# Altium project STM32F103C8T6_Mini_System.PrjPcb
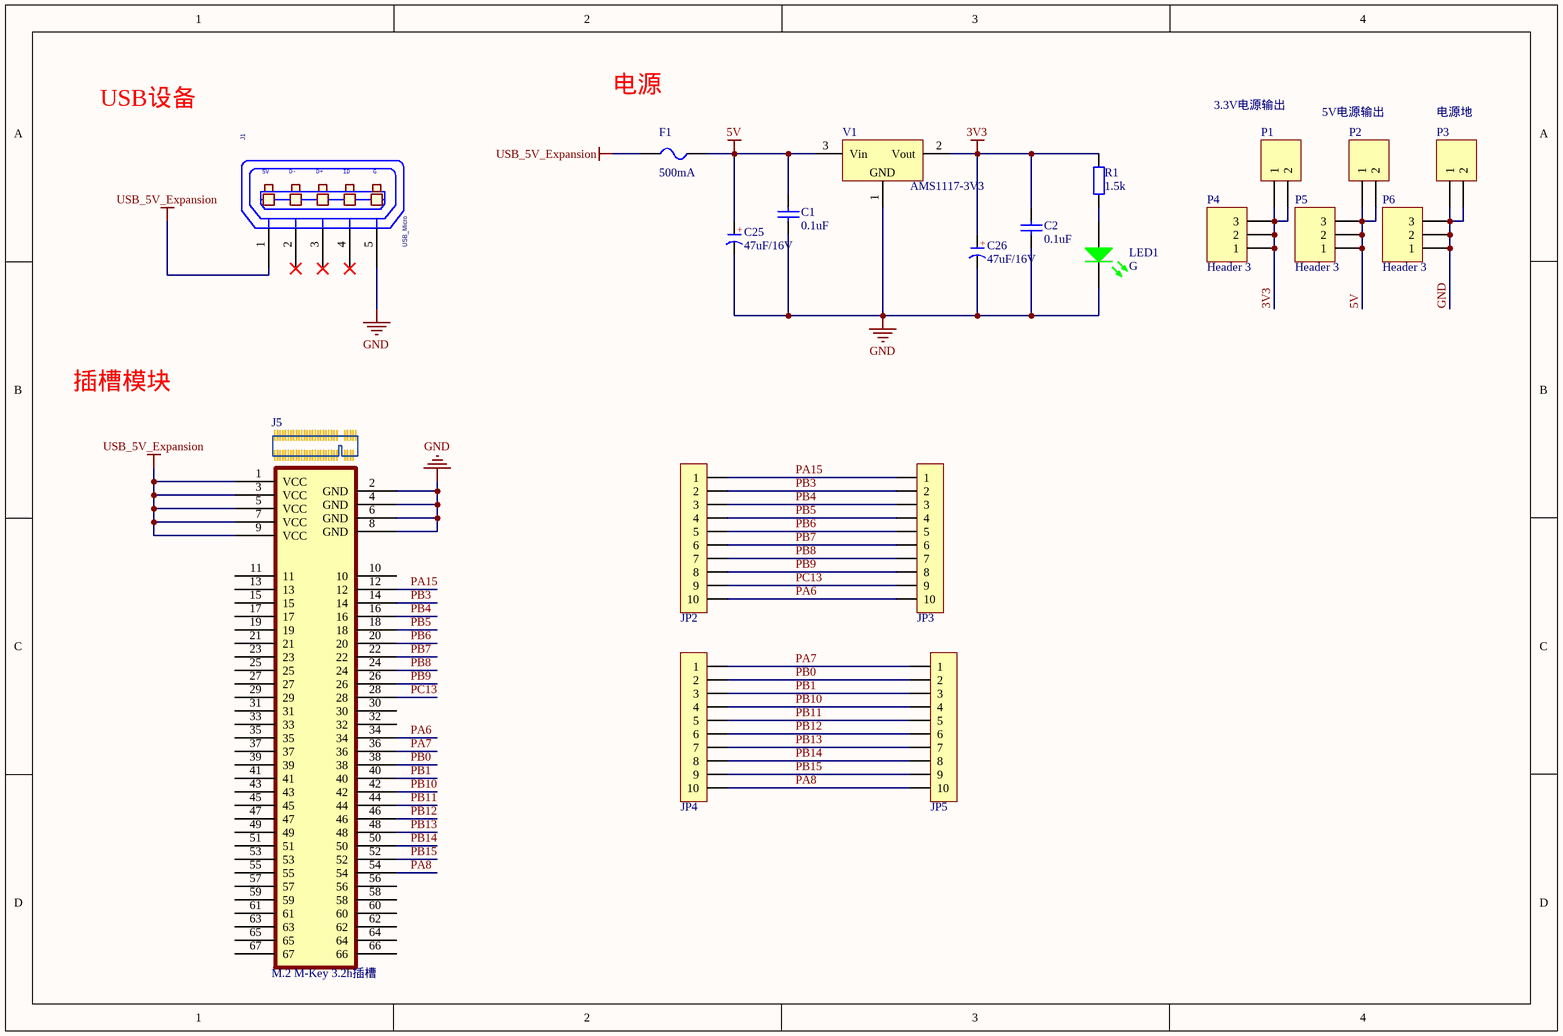
[diagram p0: Expansion_Board.SchDoc]
2 sheets, 85 parts. Net scope: global (net labels, ports and power ports of the same name join across sheets).
Board files: Expansion_Board.PcbDoc, Core_Board.PcbDoc
Sheets:
  Expansion_Board.SchDoc
  Core_Board.SchDoc

## Sheet Expansion_Board.SchDoc
size A4; SheetNumber: 1; SheetTotal: 2

### Parts
C1  0.1uF  [0805_C]
C2  0.1uF  [0805_C]
C25  47uF/16V  [CM C(5*5.4)]
C26  47uF/16V  [CM C(5*5.4)]
F1  500mA  [FU 1210]
J1  USB_Micro  [USB-MICRO]
J5  M.2 M-Key 3.2h插槽  [M-Key Socket]
JP2  HDR-1X10  [HDR2.54-LI-10P]  (value not drawn)
JP3  HDR-1X10  [HDR2.54-M-LI-10P]  (value not drawn)
JP4  HDR-1X10  [HDR2.54-LI-10P]  (value not drawn)
JP5  HDR-1X10  [HDR2.54-M-LI-10P]  (value not drawn)
LED1  G  [LED 0805G]
P1  3.3V电源输出  [KF128-5.08-2P]
P2  5V电源输出  [KF128-5.08-2P]
P3  电源地  [KF128-5.08-2P]
P4  Header 3  [HDR-1X3_M]
P5  Header 3  [HDR-1X3_M]
P6  Header 3  [HDR-1X3_M]
R1  1.5k  [0805_R]
V1  AMS1117-3V3  [SOT223]

### Nets
3V3: C2.2 C26.1(A) P1.1 P1.2 P4.1 P4.2 P4.3 R1.2 V1.2(Vout)
5V: C1.2 C25.1(A) F1.2 P2.1 P2.2 P5.1 P5.2 P5.3 V1.3(Vin)
GND: C1.1 C2.1 C25.2(K) C26.2(K) J1.5(P5) J5.2(GND) J5.4(GND) J5.6(GND) J5.8(GND) LED1.2(K) P3.1 P3.2 P6.1 P6.2 P6.3 V1.1(GND)
USB_5V_Expansion: F1.1 J1.1(P1) J5.1(VCC) J5.3(VCC) J5.5(VCC) J5.7(VCC) J5.9(VCC)
PA6: J5.34 JP2.10 JP3.10
PA7: J5.36 JP4.1 JP5.1
PA8: J5.54 JP4.10 JP5.10
PA15: J5.12 JP2.1 JP3.1
PB0: J5.38 JP4.2 JP5.2
PB1: J5.40 JP4.3 JP5.3
PB3: J5.14 JP2.2 JP3.2
PB4: J5.16 JP2.3 JP3.3
PB5: J5.18 JP2.4 JP3.4
PB6: J5.20 JP2.5 JP3.5
PB7: J5.22 JP2.6 JP3.6
PB8: J5.24 JP2.7 JP3.7
PB9: J5.26 JP2.8 JP3.8
PB10: J5.42 JP4.4 JP5.4
PB11: J5.44 JP4.5 JP5.5
PB12: J5.46 JP4.6 JP5.6
PB13: J5.48 JP4.7 JP5.7
PB14: J5.50 JP4.8 JP5.8
PB15: J5.52 JP4.9 JP5.9
PC13: J5.28 JP2.9 JP3.9
NetLED1_1: LED1.1(A) R1.1

Not connected (* = marked no-connect by the designer): J1 2(P2)* 3(P3)* 4(P4)*; J5 10 11 13 15 17 19 21 23 25 27 29 30 31 32 33 35 37 39 41 43 45 47 49 51 53 55 56 57 58 59 60 61 62 63 64 65 66 67

### Notes on the sheet
- USB设备
- 电源
- 插槽模块
- 工程名：
- 设计者：江瀚林&Jarvis
- 日期：
- 班级：
- 文档路径：
- (in symbol Cap_ELE) +
- (in symbol USB_Micro) 5V; D-; D+; ID; G

### Library data of the parts
C1 C2 = Cap_SMD: 0805贴片电容; Value: 100nF; Voltage: 63V; Published: 8-Jun-2000; Revision: July-2002: Re-released for DXP Platform.; Publisher: Altium Limited; 实物样品照片: https://item.taobao.com/item.htm?spm=a230r.1.14.32.21fd24b7VWml4d&id=37914290992&ns=1&abbucket=13#detail
C25 C26 = Cap_ELE: 电解电容
F1 = FU: 贴片保险丝; 版权归属: 源创客; BOM名称: 贴片保险丝; 学习资源: www.ooocke.com
J1 = USB_Micro: CLASS: IO; AGILE_PN: 211-80104; MFG_NAME01: ANYTRONIC CORPORATION LIMITED; MFG_PN01: 23970101#LCP-58LF; Temp_Range: -55&#8451; to 105&#8451;; CAD_APPROVED: Yes; ROHS: Yes; HEIGHT: 2.8MM
J5 = M-Key Socket
JP2-JP5 = Header 10: 10P接插件; 版权归属: 源创客; BOM名称: 10P接插件; 学习资源: www.ooocke.com
LED1 = LED_G: 绿色LED; Published: 8-Jun-2000; Revision: July-2002: Re-released for DXP Platform.; Publisher: Altium Limited
P1-P3 = Header 2: 2P接插件; LatestRevisionDate: 17-Jul-2002; LatestRevisionNote: Re-released for DXP Platform.; Publisher: Altium Limited
P4-P6 = Header 3: 3P接插件; LatestRevisionDate: 17-Jul-2002; LatestRevisionNote: Re-released for DXP Platform.; Publisher: Altium Limited
R1 = Res_SMD: 0805贴片电阻; Value: 1K; Published: 8-Jun-2000; LatestRevisionDate: 17-Jul-2002; LatestRevisionNote: Re-released for DXP Platform.; PackageReference: AXIAL-0.4; Publisher: Altium Limited; PackageDescription: Axial Device, Thru-Hole; 2 Leads; 0.4 in Pin Spacing
V1 = AMS1117: 三端稳压芯片; BOM名称: 稳压芯片; 版权归属: 源创客; 学习资源: www.ooocke.com

## Sheet Core_Board.SchDoc
size A2; SheetNumber: 2; SheetTotal: 2
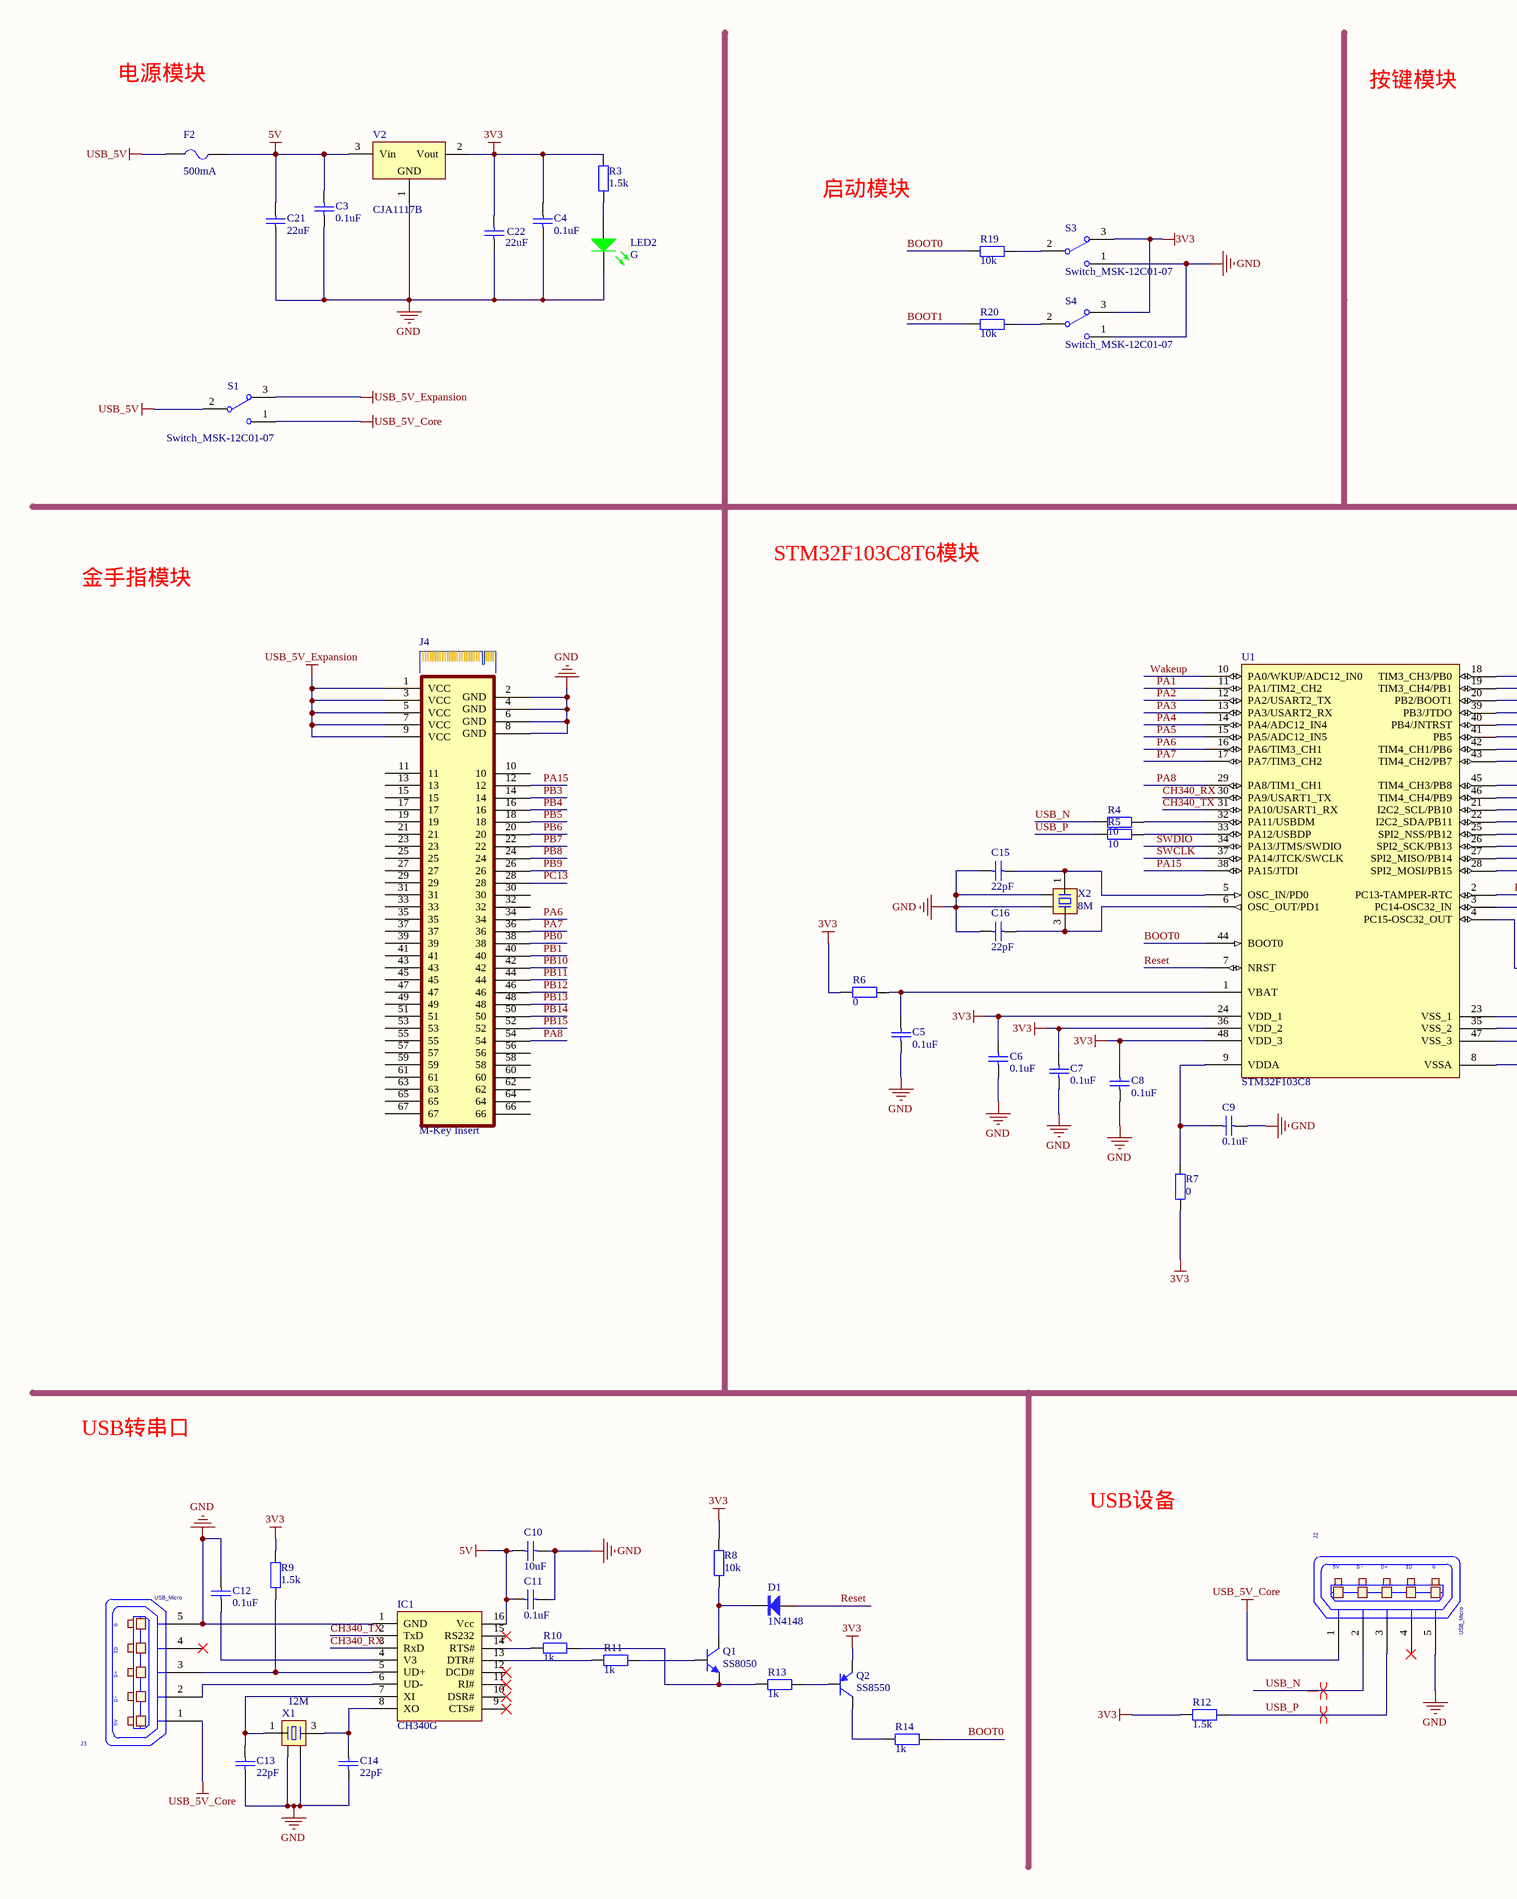
[diagram p1: Core_Board.SchDoc, left]
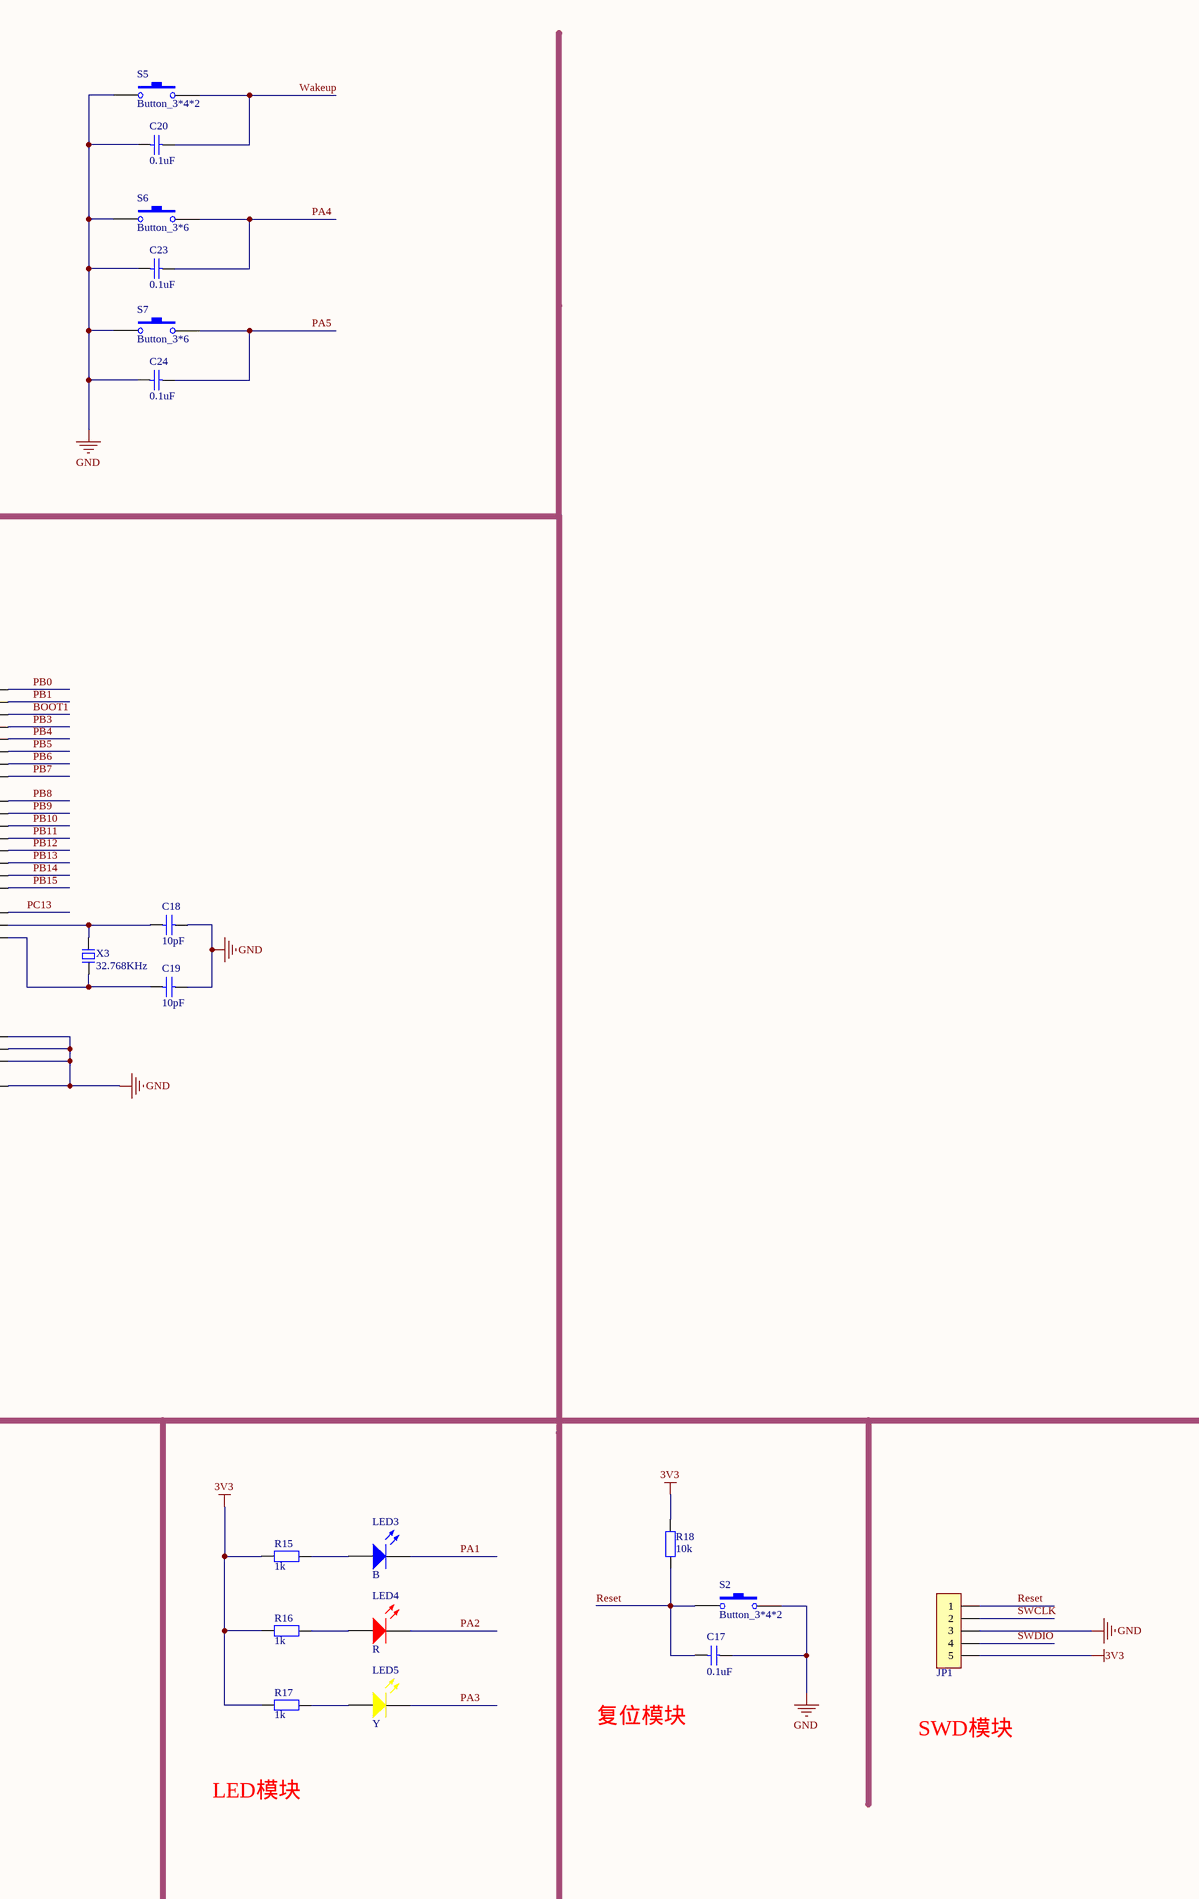
[diagram p2: Core_Board.SchDoc, right]

### Parts
C3  0.1uF  [0805_C]
C4  0.1uF  [0805_C]
C5  0.1uF  [0805_C]
C6  0.1uF  [0805_C]
C7  0.1uF  [0805_C]
C8  0.1uF  [0805_C]
C9  0.1uF  [0805_C]
C10  10uF  [0805_C]
C11  0.1uF  [0805_C]
C12  0.1uF  [0805_C]
C13  22pF  [0805_C]
C14  22pF  [0805_C]
C15  22pF  [0805_C]
C16  22pF  [0805_C]
C17  0.1uF  [0805_C]
C18  10pF  [0805_C]
C19  10pF  [0805_C]
C20  0.1uF  [0805_C]
C21  22uF  [0805_C]
C22  22uF  [0805_C]
C23  0.1uF  [0805_C]
C24  0.1uF  [0805_C]
D1  1N4148  [MINI_MELF (LL34)]
F2  500mA  [FU 1210]
IC1  CH340G  [SOP16_N]
J2  USB_Micro  [USB-MICRO]
J3  USB_Micro  [USB-MICRO]
J4  M-Key Insert  [M-Key Insert]
JP1  HDR-1X5  [XH2.54-WI-5P]  (value not drawn)
LED2  G  [LED 0805G]
LED3  B  [LED 0805B]
LED4  R  [LED 0805R]
LED5  Y  [LED 0805Y]
Q1  SS8050  [SOT23-3N]
Q2  SS8550  [SOT23-3N]
R3  1.5k  [0805_R]
R4  10  [0805_R]
R5  10  [0805_R]
R6  0  [0805_R]
R7  0  [0805_R]
R8  10k  [0805_R]
R9  1.5k  [0805_R]
R10  1k  [0805_R]
R11  1k  [0805_R]
R12  1.5k  [0805_R]
R13  1k  [0805_R]
R14  1k  [0805_R]
R15  1k  [0805_R]
R16  1k  [0805_R]
R17  1k  [0805_R]
R18  10k  [0805_R]
R19  10k  [0805_R]
R20  10k  [0805_R]
S1  Switch_MSK-12C01-07  [MSK-12C01-07]
S2  Button_3*4*2  [TSW SMD-3*4*2]
S3  Switch_MSK-12C01-07  [MSK-12C01-07]
S4  Switch_MSK-12C01-07  [MSK-12C01-07]
S5  Button_3*4*2  [TSW SMD-3*4*2]
S6  Button_3*6  [TSW SMD-3*6*4.3_V]
S7  Button_3*6  [TSW SMD-3*6*4.3_V]
U1  STM32F103C8  [LQFP48 7X7_N]
V2  CJA1117B  [SOT89_N]
X1  12M  [OSC 3225-4P]
X2  8M  [OSC 3225-4P]
X3  32.768KHz  [OSC 3215-2P]

### Nets
3V3: C4.2 C6.2 C7.2 C8.2 C22.2 JP1.5 Q2.2(E) R3.2 R6.1 R7.1 R8.2 R9.1 R12.1 R15.1 R16.1 R17.1 R18.1 S3.3 S4.3 U1.24(VDD_1) U1.36(VDD_2) U1.48(VDD_3) V2.2(Vout)
5V: C3.2 C10.2 C11.2 C21.2 F2.2 IC1.16(Vcc) V2.3(Vin)
GND: C3.1 C4.1 C5.1 C6.1 C7.1 C8.1 C9.1 C10.1 C11.1 C12.2 C13.1 C14.1 C15.2 C16.2 C17.1 C18.2 C19.2 C20.1 C21.1 C22.1 C23.1 C24.1 IC1.1(GND) J2.5(P5) J3.5(P5) J4.2(GND) J4.4(GND) J4.6(GND) J4.8(GND) JP1.3 LED2.2(K) S2.2 S3.1 S4.1 S5.1 S6.1 S7.1 U1.8(VSSA) U1.23(VSS_1) U1.35(VSS_2) U1.47(VSS_3) V2.1(GND) X1.2 X1.4 X2.2 X2.4
USB_5V: F2.1 S1.2
USB_5V_Core: J2.1(P1) J3.1(P1) S1.1
USB_5V_Expansion: J4.1(VCC) J4.3(VCC) J4.5(VCC) J4.7(VCC) J4.9(VCC) S1.3
BOOT0: R14.1 R19.1 U1.44(BOOT0)
BOOT1: R20.1 U1.20(PB2/BOOT1)
CH340_RX: IC1.3(RxD) U1.30(PA9/USART1_TX)
CH340_TX: IC1.2(TxD) U1.31(PA10/USART1_RX)
PA1: LED3.2(K) U1.11(PA1/TIM2_CH2)
PA2: LED4.2(K) U1.12(PA2/USART2_TX)
PA3: LED5.2(K) U1.13(PA3/USART2_RX)
PA4: C23.2 S6.2 U1.14(PA4/ADC12_IN4)
PA5: C24.2 S7.2 U1.15(PA5/ADC12_IN5)
PA6: J4.34 U1.16(PA6/TIM3_CH1)
PA7: J4.36 U1.17(PA7/TIM3_CH2)
PA8: J4.54 U1.29(PA8/TIM1_CH1)
PA15: J4.12 U1.38(PA15/JTDI)
PB0: J4.38 U1.18(TIM3_CH3/PB0)
PB1: J4.40 U1.19(TIM3_CH4/PB1)
PB3: J4.14 U1.39(PB3/JTDO)
PB4: J4.16 U1.40(PB4/JNTRST)
PB5: J4.18 U1.41(PB5)
PB6: J4.20 U1.42(TIM4_CH1/PB6)
PB7: J4.22 U1.43(TIM4_CH2/PB7)
PB8: J4.24 U1.45(TIM4_CH3/PB8)
PB9: J4.26 U1.46(TIM4_CH4/PB9)
PB10: J4.42 U1.21(I2C2_SCL/PB10)
PB11: J4.44 U1.22(I2C2_SDA/PB11)
PB12: J4.46 U1.25(SPI2_NSS/PB12)
PB13: J4.48 U1.26(SPI2_SCK/PB13)
PB14: J4.50 U1.27(SPI2_MISO/PB14)
PB15: J4.52 U1.28(SPI2_MOSI/PB15)
PC13: J4.28 U1.2(PC13-TAMPER-RTC)
Reset: C17.2 D1.1(A) JP1.1 R18.2 S2.1 U1.7(NRST)
SWCLK: JP1.2 U1.37(PA14/JTCK/SWCLK)
SWDIO: JP1.4 U1.34(PA13/JTMS/SWDIO)
USB_N: J2.2(P2) R4.1
USB_P: J2.3(P3) R5.1 R12.2
Wakeup: C20.2 S5.2 U1.10(PA0/WKUP/ADC12_IN0)
NetC5_2: C5.2 R6.2 U1.1(VBAT)
NetC9_2: C9.2 R7.2 U1.9(VDDA)
NetC12_1: C12.1 IC1.4(V3)
NetC13_2: C13.2 IC1.7(XI) X1.1
NetC14_2: C14.2 IC1.8(XO) X1.3
NetC15_1: C15.1 U1.5(OSC_IN/PD0) X2.1
NetC16_1: C16.1 U1.6(OSC_OUT/PD1) X2.3
NetC18_1: C18.1 U1.3(PC14-OSC32_IN) X3.2
NetC19_1: C19.1 U1.4(PC15-OSC32_OUT) X3.1
NetD1_2: D1.2(K) Q1.3(C) R8.1
NetIC1_5: IC1.5(UD+) J3.3(P3) R9.2
NetIC1_6: IC1.6(UD-) J3.2(P2)
NetIC1_13: IC1.13(DTR#) R11.1
NetIC1_14: IC1.14(RTS#) R10.1
NetLED2_1: LED2.1(A) R3.1
NetLED3_1: LED3.1(A) R15.2
NetLED4_1: LED4.1(A) R16.2
NetLED5_1: LED5.1(A) R17.2
NetQ1_1: Q1.1(B) R11.2
NetQ1_2: Q1.2(E) R10.2 R13.1
NetQ2_1: Q2.1(B) R13.2
NetQ2_3: Q2.3(C) R14.2
NetR4_2: R4.2 U1.32(PA11/USBDM)
NetR5_2: R5.2 U1.33(PA12/USBDP)
NetR19_2: R19.2 S3.2
NetR20_2: R20.2 S4.2

Not connected (* = marked no-connect by the designer): IC1 9(CTS#)* 10(DSR#)* 11(RI#)* 12(DCD#)* 15(RS232)*; J2 4(P4)*; J3 4(P4)*; J4 10 11 13 15 17 19 21 23 25 27 29 30 31 32 33 35 37 39 41 43 45 47 49 51 53 55 56 57 58 59 60 61 62 63 64 65 66 67

### Layout directives
differential pair: USB_N, USB_P

### Notes on the sheet
- 电源模块
- 按键模块
- 启动模块
- 金手指模块
- STM32F103C8T6模块
- USB转串口
- USB设备
- 复位模块
- SWD模块
- LED模块
- (in symbol USB_Micro) 5V; D-; D+; ID; G

### Library data of the parts
C3-C12 C17 C20-C24 = Cap_SMD: 0805贴片电容; Value: 100nF; Voltage: 63V; Published: 8-Jun-2000; Revision: July-2002: Re-released for DXP Platform.; Publisher: Altium Limited; 实物样品照片: https://item.taobao.com/item.htm?spm=a230r.1.14.32.21fd24b7VWml4d&id=37914290992&ns=1&abbucket=13#detail
C13-C16 C18 C19 = Cap_SMD: 贴片电容; Value: 100nF; Voltage: 63V; Published: 8-Jun-2000; Revision: July-2002: Re-released for DXP Platform.; Publisher: Altium Limited; 实物样品照片: https://item.taobao.com/item.htm?spm=a230r.1.14.32.21fd24b7VWml4d&id=37914290992&ns=1&abbucket=13#detail
D1 = 1N4148: 高速开关二极管; 版权归属: 源创客; BOM名称: 高速开关二极管; 学习资源: www.ooocke.com
F2 = FU: 贴片保险丝; 版权归属: 源创客; BOM名称: 贴片保险丝; 学习资源: www.ooocke.com
IC1 = CH340G: 串口转USB; 版权归属: 源创客; BOM名称: 串口转USB; 学习资源: www.ooocke.com
J2 J3 = USB_Micro: as J1 on sheet Expansion_Board; ROHS: Yes; HEIGHT: 2.8MM
J4 = M-Key Insert: M.2 金手指
JP1 = Header 5: 5P接插件; 版权归属: 源创客; BOM名称: 5P接插件; 学习资源: www.ooocke.com
LED2 = LED_G: 绿色LED; Published: 8-Jun-2000; Revision: July-2002: Re-released for DXP Platform.; Publisher: Altium Limited
LED3 = LED_B: 蓝色LED; Published: 8-Jun-2000; Revision: July-2002: Re-released for DXP Platform.; Publisher: Altium Limited
LED4 = LED_R: 红色LED; Published: 8-Jun-2000; Revision: July-2002: Re-released for DXP Platform.; Publisher: Altium Limited
LED5 = LED_Y: 黄色LED; Published: 8-Jun-2000; Revision: July-2002: Re-released for DXP Platform.; Publisher: Altium Limited
Q1 = 8050-SMD: 高频放大-NPN型; 版权归属: 源创客; 属性: 40V 1.5A 1W 100MHZ; BOM名称: 高频放大-NPN型; 学习资源: www.ooocke.com
Q2 = 8550-SMD: 高频放大-PNP型; 版权归属: 源创客; 属性: 40V 1.5A 1W 100MHZ; BOM名称: 高频放大-PNP型; 学习资源: www.ooocke.com
R3-R9 R12 R18-R20 = Res_SMD: 0805贴片电阻; Value: 1K; Published: 8-Jun-2000; LatestRevisionDate: 17-Jul-2002; LatestRevisionNote: Re-released for DXP Platform.; PackageReference: AXIAL-0.4; Publisher: Altium Limited; PackageDescription: Axial Device, Thru-Hole; 2 Leads; 0.4 in Pin Spacing
R10 R11 R13-R17 = Res_SMD: 0805贴片电阻; Published: 8-Jun-2000; LatestRevisionDate: 17-Jul-2002; LatestRevisionNote: Re-released for DXP Platform.; PackageReference: AXIAL-0.4; Publisher: Altium Limited; PackageDescription: Axial Device, Thru-Hole; 2 Leads; 0.4 in Pin Spacing; Value: 1K
S6 S7 = Button_3*6: 3mm*4mm*按钮长度待定; Published: 24-Mar-1999; LatestRevisionDate: 17-Jul-2002; LatestRevisionNote: Re-released for DXP Platform.; PackageReference: SPST-2; Publisher: Altium Limited
U1 = STM32F103C8: Flaah:64/RAM:20/IO:36; BOM名称: 32位STM单片机
V2 = CJA1117B: 三端稳压芯片; BOM名称: 稳压芯片; 版权归属: 源创客; 学习资源: www.ooocke.com
X1 X2 = XTAL-4P: 4脚无源晶振; 版权归属: 源创客; 负载电容: CL20pF; BOM名称: 4脚无源晶振; 学习资源: www.ooocke.com
X3 = XTAL-2P: 2脚无源脚晶振; 版权归属: 源创客; 负载电容: 10pF; BOM名称: 2脚无源脚晶振; 学习资源: www.ooocke.com
S2 S5 = Button_3*4*2: Published: 24-Mar-1999; LatestRevisionDate: 17-Jul-2002; LatestRevisionNote: Re-released for DXP Platform.; PackageReference: SPST-2; Publisher: Altium Limited

## Nets that join several sheets
3V3: Expansion_Board (9 pins), Core_Board (23 pins)
5V: Expansion_Board (9 pins), Core_Board (7 pins)
GND: Expansion_Board (16 pins), Core_Board (46 pins)
USB_5V_Expansion: Expansion_Board (7 pins), Core_Board (6 pins)
PA6: Expansion_Board (J5.34 JP2.10 JP3.10), Core_Board (J4.34 U1.16)
PA7: Expansion_Board (J5.36 JP4.1 JP5.1), Core_Board (J4.36 U1.17)
PA8: Expansion_Board (J5.54 JP4.10 JP5.10), Core_Board (J4.54 U1.29)
PA15: Expansion_Board (J5.12 JP2.1 JP3.1), Core_Board (J4.12 U1.38)
PB0: Expansion_Board (J5.38 JP4.2 JP5.2), Core_Board (J4.38 U1.18)
PB1: Expansion_Board (J5.40 JP4.3 JP5.3), Core_Board (J4.40 U1.19)
PB3: Expansion_Board (J5.14 JP2.2 JP3.2), Core_Board (J4.14 U1.39)
PB4: Expansion_Board (J5.16 JP2.3 JP3.3), Core_Board (J4.16 U1.40)
PB5: Expansion_Board (J5.18 JP2.4 JP3.4), Core_Board (J4.18 U1.41)
PB6: Expansion_Board (J5.20 JP2.5 JP3.5), Core_Board (J4.20 U1.42)
PB7: Expansion_Board (J5.22 JP2.6 JP3.6), Core_Board (J4.22 U1.43)
PB8: Expansion_Board (J5.24 JP2.7 JP3.7), Core_Board (J4.24 U1.45)
PB9: Expansion_Board (J5.26 JP2.8 JP3.8), Core_Board (J4.26 U1.46)
PB10: Expansion_Board (J5.42 JP4.4 JP5.4), Core_Board (J4.42 U1.21)
PB11: Expansion_Board (J5.44 JP4.5 JP5.5), Core_Board (J4.44 U1.22)
PB12: Expansion_Board (J5.46 JP4.6 JP5.6), Core_Board (J4.46 U1.25)
PB13: Expansion_Board (J5.48 JP4.7 JP5.7), Core_Board (J4.48 U1.26)
PB14: Expansion_Board (J5.50 JP4.8 JP5.8), Core_Board (J4.50 U1.27)
PB15: Expansion_Board (J5.52 JP4.9 JP5.9), Core_Board (J4.52 U1.28)
PC13: Expansion_Board (J5.28 JP2.9 JP3.9), Core_Board (J4.28 U1.2)